# EAGLE design ATmega16A (EAGLE 6.6.0)
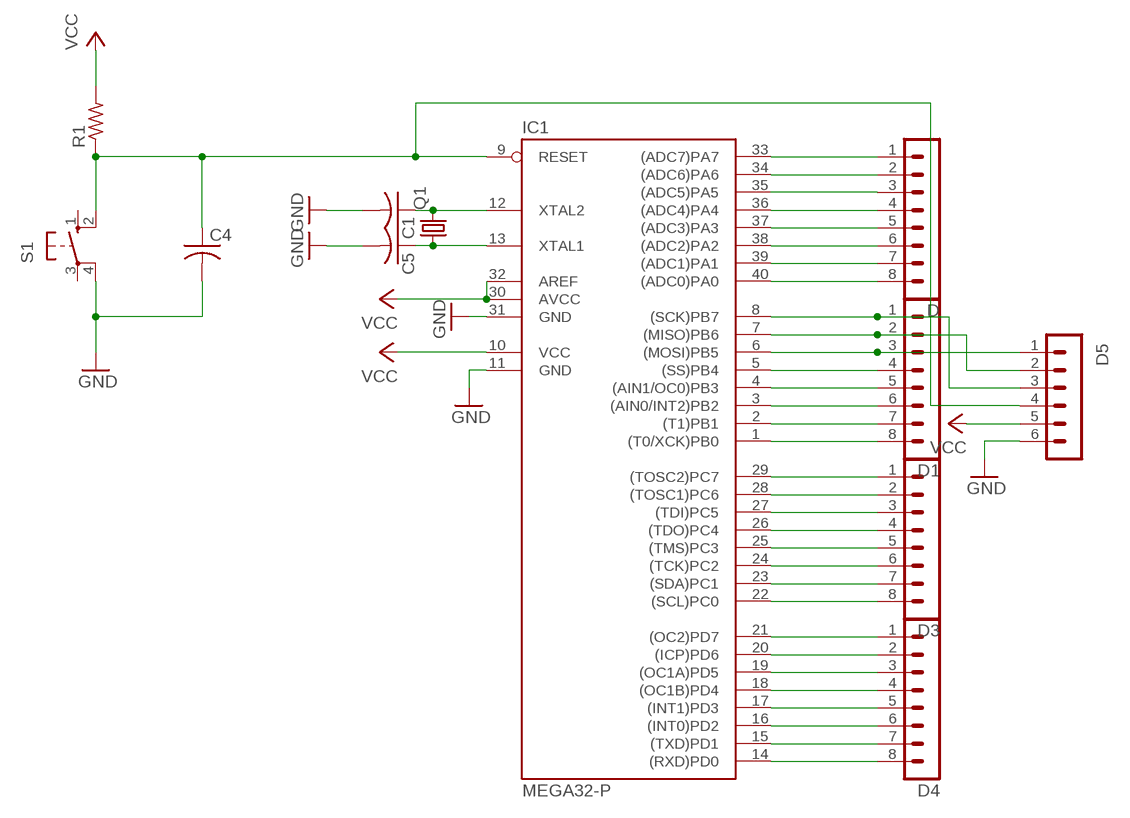
[diagram p0: schematic, sheet 1]

## Parts
C1  C-US025-025X050  [C025-025X050]
C4  C-US025-025X050  [C025-025X050]
C5  C-US025-025X050  [C025-025X050]
D  MA08-1  [MA08-1]
D1  MA08-1  [MA08-1]
D3  MA08-1  [MA08-1]
D4  MA08-1  [MA08-1]
D5  MA06-1  [MA06-1]
IC1  MEGA32-P  [DIL40]
Q1  CRYSTALHC49S  [HC49/S]
R1  R-US_0204/7  [0204/7]
S1  10-XX  [B3F-10XX]

## Nets
GND: C1.2 C4.2 C5.2 D5.6 IC1.11(GND) IC1.31(GND) S1.4(P1)
N$1: D.1 IC1.33((ADC7)PA7)
N$2: D.2 IC1.34((ADC6)PA6)
N$3: D.3 IC1.35((ADC5)PA5)
N$4: D.4 IC1.36((ADC4)PA4)
N$5: D.5 IC1.37((ADC3)PA3)
N$6: D.6 IC1.38((ADC2)PA2)
N$7: D.7 IC1.39((ADC1)PA1)
N$8: D.8 IC1.40((ADC0)PA0)
N$9: D1.1 D5.3 IC1.8((SCK)PB7)
N$10: D1.2 D5.2 IC1.7((MISO)PB6)
N$11: D1.3 D5.1 IC1.6((MOSI)PB5)
N$12: D1.4 IC1.5((SS)PB4)
N$13: D1.5 IC1.4((AIN1/OC0)PB3)
N$14: D1.6 IC1.3((AIN0/INT2)PB2)
N$15: D1.7 IC1.2((T1)PB1)
N$16: D1.8 IC1.1((T0/XCK)PB0)
N$17: D3.1 IC1.29((TOSC2)PC7)
N$18: D3.2 IC1.28((TOSC1)PC6)
N$19: D3.3 IC1.27((TDI)PC5)
N$20: D3.4 IC1.26((TDO)PC4)
N$21: D3.5 IC1.25((TMS)PC3)
N$22: D3.6 IC1.24((TCK)PC2)
N$23: D3.7 IC1.23((SDA)PC1)
N$24: D3.8 IC1.22((SCL)PC0)
N$25: D4.1 IC1.21((OC2)PD7)
N$26: D4.2 IC1.20((ICP)PD6)
N$27: D4.3 IC1.19((OC1A)PD5)
N$28: D4.4 IC1.18((OC1B)PD4)
N$29: D4.5 IC1.17((INT1)PD3)
N$30: D4.6 IC1.16((INT0)PD2)
N$31: D4.7 IC1.15((TXD)PD1)
N$32: D4.8 IC1.14((RXD)PD0)
N$33: C1.1 IC1.12(XTAL2) Q1.2
N$34: C5.1 IC1.13(XTAL1) Q1.1
N$35: C4.1 D5.4 IC1.9(RESET) R1.1 S1.2(S1)
VCC: D5.5 IC1.10(VCC) IC1.30(AVCC) IC1.32(AREF) R1.2
Unconnected: S1.1(S) S1.3(P)

## Library data of the parts
C1 C4 C5 = rcl:C-US: CAPACITOR, American symbol
D D1 D3 D4 = con-lstb:MA08-1: PIN HEADER; OC_FARNELL: unknown; OC_NEWARK: unknown
D5 = con-lstb:MA06-1: PIN HEADER; OC_FARNELL: unknown; OC_NEWARK: unknown
IC1 = atmel:MEGA32-P: MICROCONTROLLER 32 Kbytes FLASH 2 Kbytes SRAM 1 Kbytes EEPROM USART 8-channel 10 bit ADC Source: www.atmel.com .. doc2503.pdf; MPN: ATMEGA32-16PU; OC_FARNELL: 1661729; OC_NEWARK: 51P1794
Q1 = crystal:CRYSTAL: CRYSTAL; OC_FARNELL: 1667008; OC_NEWARK: unknown
R1 = resistor:R-US_: RESISTOR, American symbol
S1 = switch-omron:10-XX: OMRON SWITCH; MPN: B3F-1000; OC_FARNELL: 176432; OC_NEWARK: 36M3542

## Board
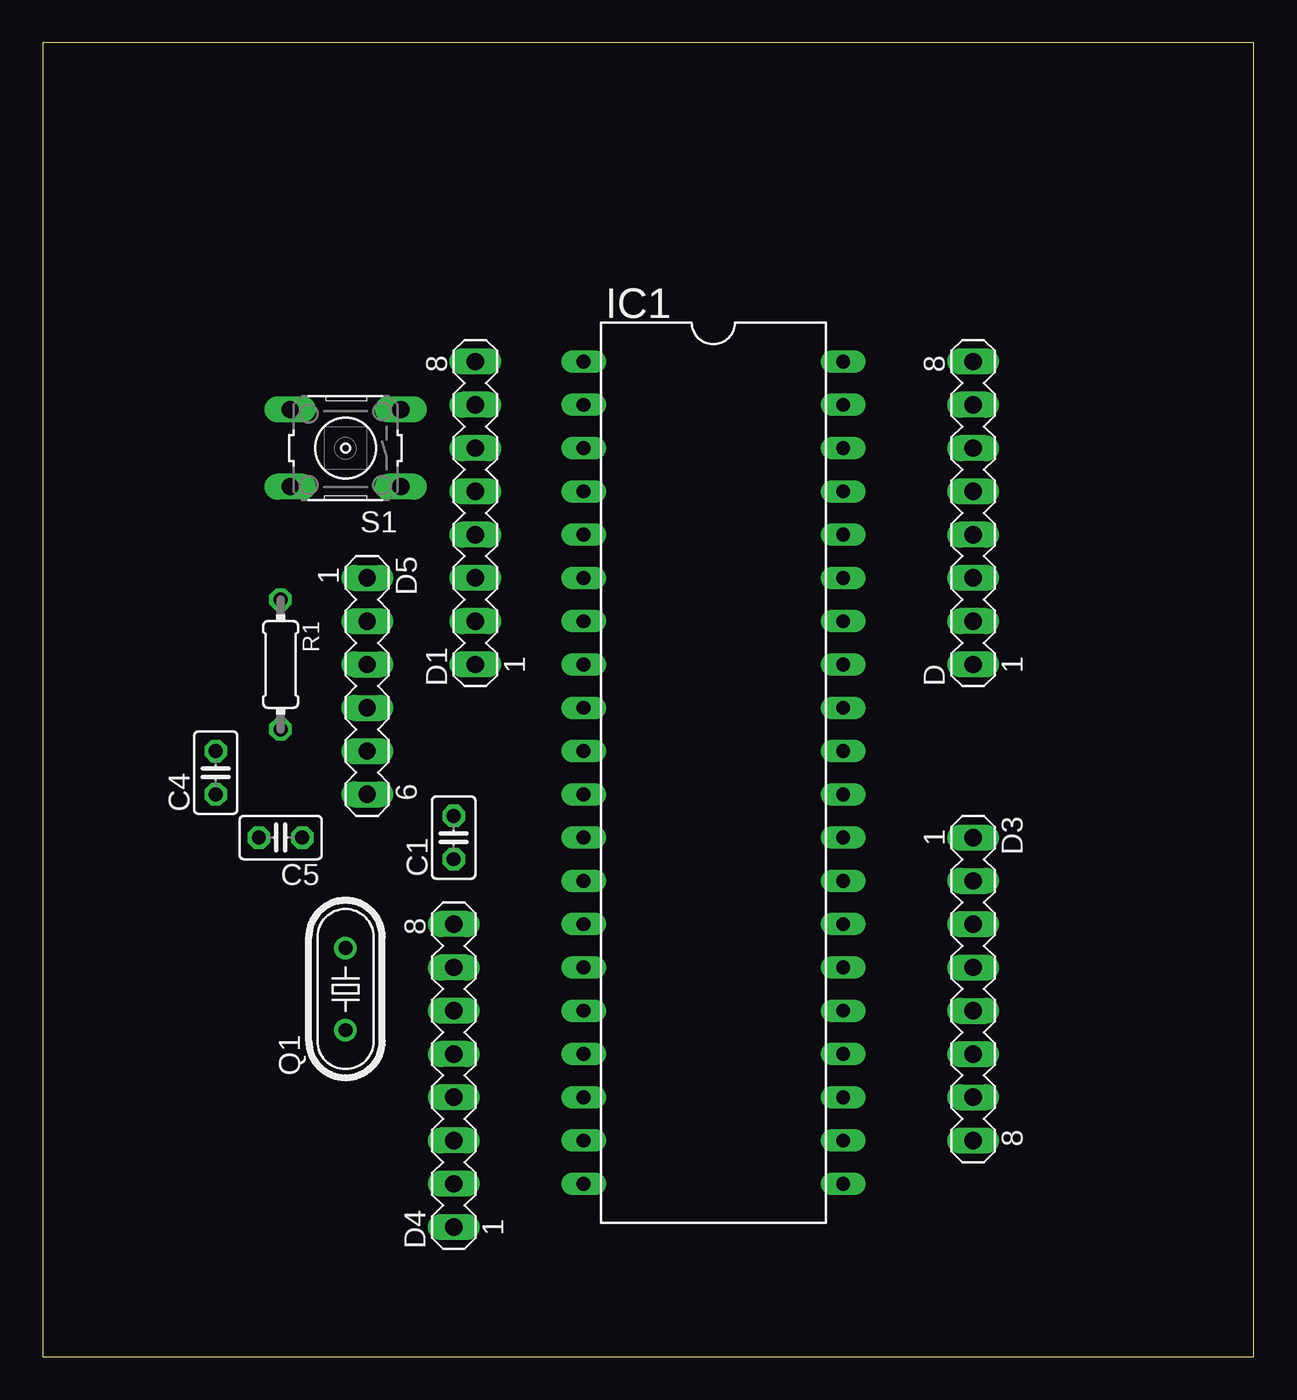
[diagram p1: board, top side]
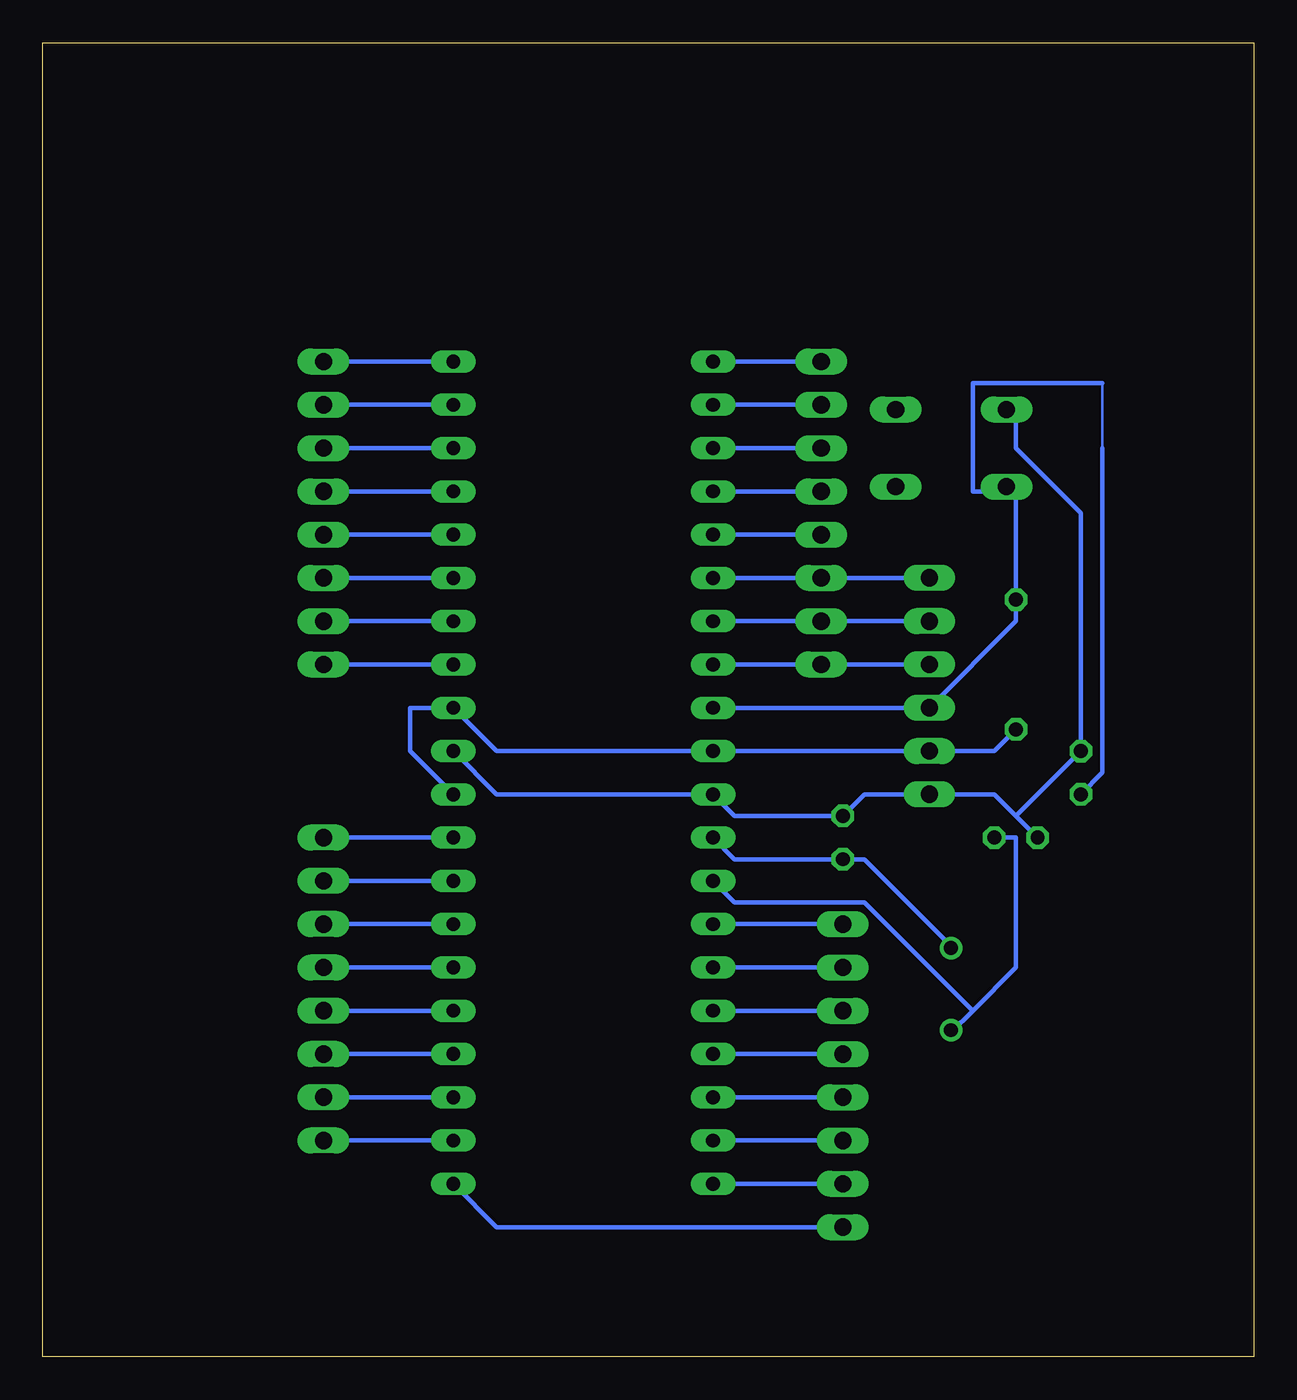
[diagram p2: board, bottom side, seen from below]

Size 71.1 x 77.14 mm. Coordinates in mm from the lower left corner, seen from the top.
Outline: 0,0 71.1,0 71.1,77.14 0,77.14 0,0
Copper layers (1*16): Top 0.035mm / dielectric 1.5mm / Bottom 0.035mm
Design rules "default": minimum track width 10mil, minimum drill 24mil, track to track 8mil, track to pad 8mil, pad to pad 8mil, via to via 8mil, smd to smd 8mil, copper to edge 40mil, drill to drill 8mil, minimum pad ring 10mil, minimum via ring 8mil, stop-mask expansion 4mil, vias tented up to drill 0mil, thermal gap 10mil

### Footprints (pad centres in the part's own frame; a part is rotated, then mirrored left to right if it is on the bottom)
C025-025X050 = drill 0.813 octagon: 1 -1.27,0; 2 1.27,0
MA08-1 = drill 1.016 long: 1 -8.89,0; 2 -6.35,0; 3 -3.81,0; 4 -1.27,0; 5 1.27,0; 6 3.81,0; 7 6.35,0; 8 8.89,0
MA06-1 = drill 1.016 long: 1 -6.35,0; 2 -3.81,0; 3 -1.27,0; 4 1.27,0; 5 3.81,0; 6 6.35,0
DIL40 = drill 0.813 long: 1 -24.13,-7.62; 2 -21.59,-7.62; 3 -19.05,-7.62; 4 -16.51,-7.62; 5 -13.97,-7.62; 6 -11.43,-7.62; 7 -8.89,-7.62; 8 -6.35,-7.62; 9 -3.81,-7.62; 10 -1.27,-7.62; 11 1.27,-7.62; 12 3.81,-7.62; 13 6.35,-7.62; 14 8.89,-7.62; 15 11.43,-7.62; 16 13.97,-7.62; 17 16.51,-7.62; 18 19.05,-7.62; 19 21.59,-7.62; 20 24.13,-7.62; 21 24.13,7.62; 22 21.59,7.62; 23 19.05,7.62; 24 16.51,7.62; 25 13.97,7.62; 26 11.43,7.62; 27 8.89,7.62; 28 6.35,7.62; 29 3.81,7.62; 30 1.27,7.62; 31 -1.27,7.62; 32 -3.81,7.62; 33 -6.35,7.62; 34 -8.89,7.62; 35 -11.43,7.62; 36 -13.97,7.62; 37 -16.51,7.62; 38 -19.05,7.62; 39 -21.59,7.62; 40 -24.13,7.62
HC49/S = drill 0.813: 1 -2.413,0; 2 2.413,0
0204/7 = drill 0.813 octagon: 1 -3.81,0; 2 3.81,0
B3F-10XX = drill 1.016 long: 1 -3.251,2.261; 2 3.251,2.261; 3 -3.251,-2.261; 4 3.251,-2.261

### Placement (x,y rotation side)
C1  24.13,30.48 90 top
C4  10.16,34.29 90 top
C5  13.97,30.48 180 top
D  54.61,49.53 90 top
D1  25.4,49.53 90 top
D3  54.61,21.59 270 top
D4  24.13,16.51 90 top
D5  19.05,39.37 270 top
IC1  39.37,34.29 270 top
Q1  17.78,21.59 90 top
R1  13.97,40.64 270 top
S1  17.78,53.34 180 top

### Tracks (layer width: path | path; a pad name or v marks a point on that pad's centre or on a via)
GND
  Bottom 0.254: 13.97,31.75 15.24,33.02 D5.6 22.86,33.02 C1.2 30.48,31.75 IC1.11 44.45,33.02 IC1.31 | 13.97,31.75 C5.2 | 13.97,31.75 C4.2 10.16,49.53 13.97,53.34 13.97,55.88 S1.4
N$1
  Bottom 0.254: D.1 IC1.33
N$2
  Bottom 0.254: D.2 IC1.34
N$3
  Bottom 0.254: D.3 IC1.35
N$4
  Bottom 0.254: D.4 IC1.36
N$5
  Bottom 0.254: D.5 IC1.37
N$6
  Bottom 0.254: D.6 IC1.38
N$7
  Bottom 0.254: D.7 IC1.39
N$8
  Bottom 0.254: D.8 IC1.40
N$9
  Bottom 0.254: IC1.8 D1.1 D5.3
N$10
  Bottom 0.254: IC1.7 D1.2 D5.2
N$11
  Bottom 0.254: IC1.6 D1.3 D5.1
N$12
  Bottom 0.254: D1.4 IC1.5
N$13
  Bottom 0.254: D1.5 IC1.4
N$14
  Bottom 0.254: D1.6 IC1.3
N$15
  Bottom 0.254: D1.7 IC1.2
N$16
  Bottom 0.254: D1.8 IC1.1
N$17
  Bottom 0.254: D3.1 IC1.29
N$18
  Bottom 0.254: D3.2 IC1.28
N$19
  Bottom 0.254: D3.3 IC1.27
N$20
  Bottom 0.254: D3.4 IC1.26
N$21
  Bottom 0.254: D3.5 IC1.25
N$22
  Bottom 0.254: D3.6 IC1.24
N$23
  Bottom 0.254: D3.7 IC1.23
N$24
  Bottom 0.254: D3.8 IC1.22
N$25
  Bottom 0.254: IC1.21 44.45,7.62 D4.1
N$26
  Bottom 0.254: D4.2 IC1.20
N$27
  Bottom 0.254: D4.3 IC1.19
N$28
  Bottom 0.254: D4.4 IC1.18
N$29
  Bottom 0.254: D4.5 IC1.17
N$30
  Bottom 0.254: D4.6 IC1.16
N$31
  Bottom 0.254: D4.7 IC1.15
N$32
  Bottom 0.254: D4.8 IC1.14
N$33
  Bottom 0.254: Q1.2 17.78,24.13 22.86,29.21 C1.1 30.48,29.21 IC1.12
N$34
  Bottom 0.254: 16.51,20.32 13.97,22.86 13.97,30.48 C5.1 | 16.51,20.32 17.78,19.05 Q1.1 | IC1.13 30.48,26.67 22.86,26.67 16.51,20.32
N$35
  Bottom 0.152: 8.89,57.15 8.89,53.34
  Bottom 0.254: IC1.9 D5.4 13.97,43.18 R1.1 13.97,50.8 S1.2 15.24,50.8 16.51,50.8 16.51,57.15 8.89,57.15 | C4.1 8.89,34.29 8.89,53.34
VCC
  Bottom 0.254: IC1.30 49.53,35.56 49.53,38.1 IC1.32 44.45,35.56 IC1.10 D5.5 15.24,35.56 R1.2